# Altium schematic sheet 01-Insence_Power.SchDoc
size B; SheetNumber: 1
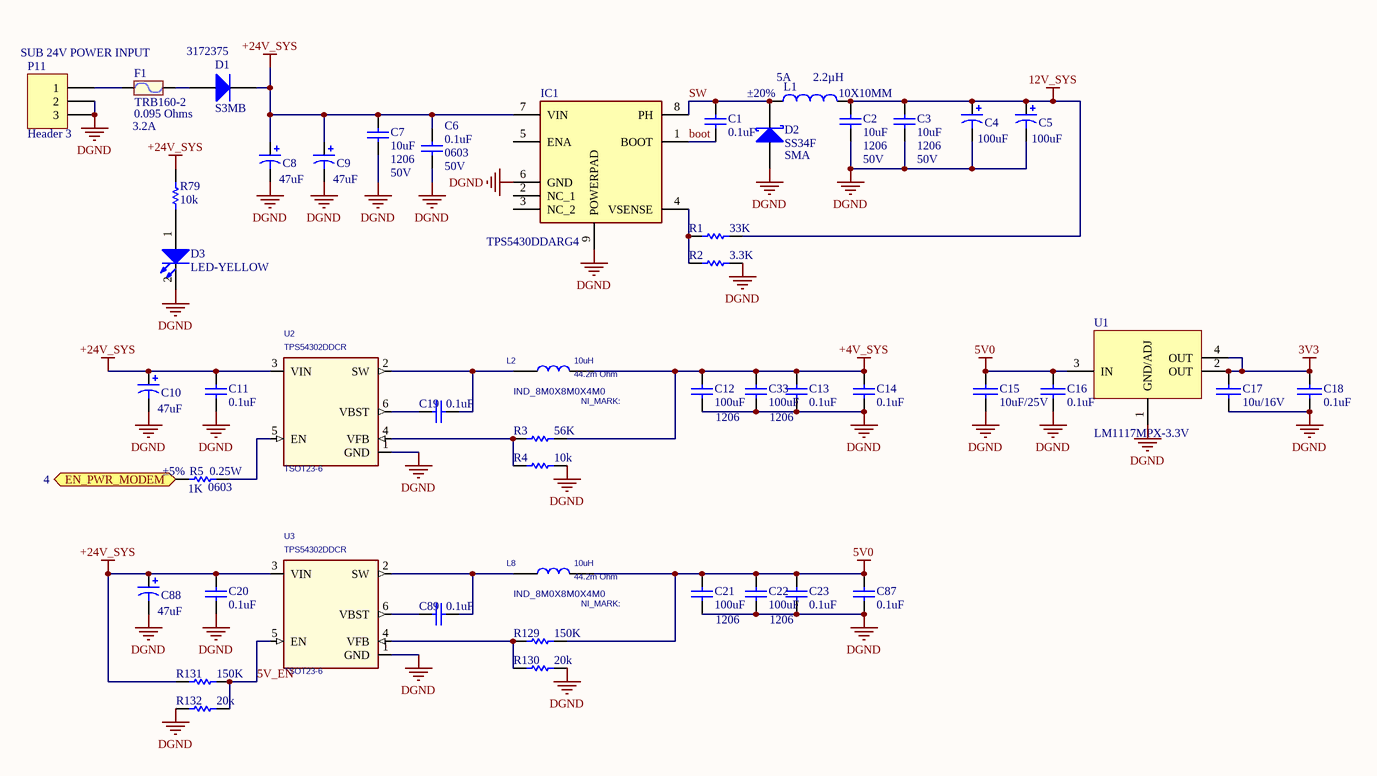
[diagram p0: 01-Insence_Power.SchDoc]

## Parts
C1  =Value: 0.1uF  [0805]  (hidden comment: Cap)
C2  FOOTPRINT: 1206  Voltage: 50V  [CAP 1206]  (hidden comment: 10uF)
C3  FOOTPRINT: 1206  Voltage: 50V  [CAP 1206]  (hidden comment: 10uF)
C4  100uF  [CAP ALUM SMD-D Package 6.3x5.4mm]
C5  100uF  [CAP ALUM SMD-D Package 6.3x5.4mm]
C6  FOOTPRINT: 0603  Voltage: 50V  [CAP 0603]  (hidden comment: 0.1uF)
C7  FOOTPRINT: 1206  Voltage: 50V  [CAP 1206]  (hidden comment: 10uF)
C8  47uF  [CAP ALUM SMD-D Package 6.3x5.4mm]
C9  47uF  [CAP ALUM SMD-D Package 6.3x5.4mm]
C10  47uF  [CAP ALUM SMD-D Package 6.3x5.4mm]
C11  =Value: 0.1uF  [0805]  (hidden comment: Cap)
C12  PCB FOOTPRINT: 1206  [CAP 1206]  (hidden comment: 100uF)
C13  =Value: 0.1uF  [0805]  (hidden comment: Cap)
C14  =Value: 0.1uF  [0805]  (hidden comment: Cap)
C15  10uF/25V  [0805]
C16  0.1uF  [0805]
C17  10u/16V  [0805]
C18  0.1uF  [0805]
C19  =Value: 0.1uF  [CAP 0603]  (hidden comment: Cap)
C20  =Value: 0.1uF  [0805]  (hidden comment: Cap)
C21  PCB FOOTPRINT: 1206  [CAP 1206]  (hidden comment: 100uF)
C22  PCB FOOTPRINT: 1206  [CAP 1206]  (hidden comment: 100uF)
C23  =Value: 0.1uF  [0805]  (hidden comment: Cap)
C33  PCB FOOTPRINT: 1206  [CAP 1206]  (hidden comment: 100uF)
C87  =Value: 0.1uF  [0805]  (hidden comment: Cap)
C88  47uF  [CAP ALUM SMD-D Package 6.3x5.4mm]
C89  =Value: 0.1uF  [CAP 0603]  (hidden comment: Cap)
D1  S3MB  Supplier Part Number 1: 3172375  [DO-214AB]
D2  SS34F  [SMA]
D3  LED-YELLOW  [led3mm_ra]
F1  DC Cold Resistance: 0.095 Ohms  Current Rating (Amps): 3.2A  [TRB160-2]  (hidden comment: TRB160-2)
IC1  TPS5430DDARG4  [SOIC127P600X170-9N]
L1  PCB Footprint: 10X10MM  RATE Current: 5A  Tolerance: ±20%  [IND 8x8MM]  (hidden comment: 2.2µH)
L2  10uH  PACKAGE: IND_8M0X8M0X4M0  DCR: 44.2m Ohm  [IND 8x8MM]
L8  10uH  PACKAGE: IND_8M0X8M0X4M0  DCR: 44.2m Ohm  [IND 8x8MM]
P11  Header 3  [DC-in]
R1  value 33K  [res 0603]  (hidden comment: Res1)
R2  value 3.3K  [res 0603]  (hidden comment: Res1)
R3  value 56K  [res 0603]  (hidden comment: Res1)
R4  value 10k  [res 0603]  (hidden comment: Res1)
R5  PCB Footprint: 0603  Power: 0.25W  Tolerance: ±5%  [res 0603]  (hidden comment: 1K)
R79  value 10k  [res 0603]  (hidden comment: Res1)
R129  value 150K  [res 0603]  (hidden comment: Res1)
R130  value 20k  [res 0603]  (hidden comment: Res1)
R131  value 150K  [res 0603]  (hidden comment: Res1)
R132  value 20k  [res 0603]  (hidden comment: Res1)
U1  LM1117MPX-3.3V  [SOT223]
U2  TPS54302DDCR  PACKAGE: TSOT23-6  [SOT23-6]
U3  TPS54302DDCR  PACKAGE: TSOT23-6  [SOT23-6]

## Ports
EN_PWR_MODEM (bidir, see 4)

## Nets
3V3: C17.1 C18.1 U1.2(OUT) U1.4(OUT)
5V0: C15.1 C16.1 C21.1 C22.1 C23.2 C87.2 L8.2(B) R129.2 U1.3(IN)
12V_SYS: C2.2 C3.2 C4.1 C5.1 L1.2 R1.2
+4V_SYS: C12.1 C13.2 C14.2 C33.1 L2.2(B) R3.2
+24V_SYS: C6.2 C7.2 C8.1 C9.1 C10.1 C11.2 C20.2 C88.1 D1.2(K) IC1.7(VIN) R79.2 R131.1 U2.3(VIN) U3.3(VIN)
DGND: C2.1 C3.1 C4.2 C5.2 C6.1 C7.1 C8.2 C9.2 C10.2 C11.1 C12.2 C13.1 C14.1 C15.2 C16.2 C17.2 C18.2 C20.1 C21.2 C22.2 C23.1 C33.2 C87.1 C88.2 D2.1(A) D3.2(K) IC1.6(GND) IC1.9(POWERPAD) P11.2 P11.3 R2.2 R4.2 R130.2 R132.1 U1.1(GND/ADJ) U2.1(GND) U3.1(GND)
5V_EN: R131.2 R132.2 U3.5(EN)
boot: C1.1 IC1.1(BOOT)
EN_PWR_MODEM: R5.2 ; port EN_PWR_MODEM
SW: C1.2 D2.2(K) IC1.8(PH) L1.1
NetC19_1: C19.1 U2.6(VBST)
NetC19_2: C19.2 L2.1(A) U2.2(SW)
NetC89_1: C89.1 U3.6(VBST)
NetC89_2: C89.2 L8.1(A) U3.2(SW)
NetD1_1: D1.1(A) F1.2
NetD3_1: D3.1(A) R79.1
NetF1_1: F1.1 P11.1
NetIC1_4: IC1.4(VSENSE) R1.1 R2.1
NetR3_1: R3.1 R4.1 U2.4(VFB)
NetR5_1: R5.1 U2.5(EN)
NetR129_1: R129.1 R130.1 U3.4(VFB)

Not connected (* = marked no-connect by the designer): IC1 2(NC_1) 3(NC_2) 5(ENA)

## Notes on the sheet
- SUB 24V POWER INPUT

## Library data of the parts
C1 C11 C13 C14 C20 C23 C87 = Cap: CAP CER 0.1UF 50V X7R 0805; MANUFACTURER1: Cal-Chip Electronics, Inc.; MANUFACTURER1_PART#: GMC21X7R104M50NT; Published: 8-Jun-2000; LatestRevisionDate: 17-Jul-2002; LatestRevisionNote: Re-released for DXP Platform.; PackageReference: RAD-0.3; Publisher: Altium Limited; PackageDescription: Radial Cap, Thru-Hole; 2 Leads; 0.3 in Pin Spacing
C2 C3 C7 = Cap: CAP CER 10UF 50V X5R 1206; MANUFACTURER1: Samsung Electro-Mechanics; MANUFACTURER1_PART#: CL31A106MBHNNNE; MANUFACTURER1: SS; Unit: PCS; Material: X7R; PACKING: Tape & Reel (TR); Process Type: SM; Tolerance: ±10%; CATEGORY: CAP-CER; VALUE: 10uF; PCB FOOTPRINT: 1206
C4 C5 = Cap TANTAN 100UF35V2917_1: CAP ALUM 100UF 20% 16V SMD; MANUFACTURER1_PART#: UWX1C101MCL1GB; MANUFACTURER1: Nichicon; MANUFACTURER2_PART#: EDK107M016A9GAA; TEMP: 0-85; DIA: 6.3mm; Value: 100uF; MANUFACTURER2: KEMET; LOH_CODE: *; VOLTAGE: 16V; TOLERANCE: 20%; CATEGORY: CAP-POL-SMD
C6 = Cap: CAP-CER,SMD;0.1UF,10%,50V,X7R,0603; MANUFACTURER1: Samsung Electro-Mechanics; MANUFACTURER1_PART#: CL10B104KB8NNNC; MANUFACTURER2_PART#: M0603X104K050TAX; MANUFACTURER1: SS; Unit: PCS; PACKING: Tape & Reel (TR); Process Type: SM; CATEGORY: CAP-CER; VALUE: 0.1uF; Material: X7R; PCB FOOTPRINT: 0603; Tolerance: ±10%; MANUFACTURER2: UWA
C8-C10 C88 = Cap TANTAN 47UF35V2917: CAP ALUM 47UF 20% 35V SMD; MANUFACTURER1_PART#: UUR1V470MCL6GS; MANUFACTURER1: Nichicon; MANUFACTURER2_PART#: EDK476M035A9GAA; TEMP: 0-85; DIA: 6.3mm; Value: 47uF; MANUFACTURER2: KEMET; LOH_CODE: *; VOLTAGE: 35V; TOLERANCE: 20%; CATEGORY: CAP-POL-SMD
C12 C21 C22 C33 = Cap: CAP CER 100UF 6.3V X5R 1206; MANUFACTURER1: Taiyo Yuden; MANUFACTURER1_PART#: JMK316BJ107ML-T; MANUFACTURER2_PART#: JMK107BJ475KA-T; Unit: PCS; PACKING: Tape & Reel (TR); Process Type: SM; Tolerance: ±10%; CATEGORY: CAP-CER; VALUE: 100uF; Material: X5R; Voltage: 6.3V; MANUFACTURER2: Yageo
C15 = CAP: CAP CER 10UF 25V X5R 0805; MANUFACTURER1: Cal-Chip Electronics, Inc.; MANUFACTURER1_PART#: GMC21X5R106M25NT
C16 C18 = CAP: CAP CER 0.1UF 50V X7R 0805; MANUFACTURER1: Cal-Chip Electronics, Inc.; MANUFACTURER1_PART#: GMC21X7R104M50NT
C17 = CAP: CAP CER 10UF 16V X5R 0805; MANUFACTURER1: Cal-Chip Electronics, Inc.; MANUFACTURER1_PART#: GMC21X5R106K16NT
C19 C89 = Cap: CAP CER 0.1UF 50V X5R 0603; MANUFACTURER1: Cal-Chip Electronics, Inc.; MANUFACTURER1_PART#: GMC10X5R104M50NT; Published: 8-Jun-2000; LatestRevisionDate: 17-Jul-2002; LatestRevisionNote: Re-released for DXP Platform.; PackageReference: RAD-0.3; Publisher: Altium Limited; PackageDescription: Radial Cap, Thru-Hole; 2 Leads; 0.3 in Pin Spacing
D1 = Diode: Default Diode; MANUFACTURER1: Diodes; MANUFACTURER1_PART#: S3MB-13-F; Published: 8-Jun-2000; LatestRevisionDate: 17-Jul-2002; LatestRevisionNote: Re-released for DXP Platform.; PackageVersion: Sep-1996; PackageReference: SMC; Publisher: Altium Limited; PackageDescription: DO-214-AB/SMC; 2 C-Bend Leads; Body 7.9 x 5.9 mm, inc. leads (LxW); Code_JEDEC: DO-214-AB; Supplier 1: Future Electronics
D2 = D Schottky: Diode 40 V 3A Surface Mount SMAF; MANUFACTURER1: MDD; Published: 8-Jun-2000; LatestRevisionDate: 17-Jul-2002; LatestRevisionNote: Re-released for DXP Platform.; PackageReference: SMA; Publisher: Altium Limited; PackageDescription: DO-214-AA/SMB; 2 C-Bend Leads; Body 5.3 x 3.6 mm, inc. leads (LxW); Code_JEDEC: DO-214-AA; Supplier 1: Newark; Supplier Part Number 1: 90AJ6552; MANUFACTURER1_PART#: SS34F
D3 = LED-RED: LED_3MM,2V,20mA,GREEN; PACKING: Tape & Reel (TR); Process Type: SM; Unit: PCS; Value: LED GREEN; Category: LED SMD; PCB Footprint: LED_3MM; MANUFACTURER1_PART#: https://banlinhkien.com/led-3mm-xanh-la-duc-10c-p12117293.html
F1 = 0875.800MXEP: Polymeric 30V 3.2A 8s 95mO Through Hole,P=5.1mm,L=3.8mm PTC; MANUFACTURER2_PART#: JK30-160; MANUFACTURER1: TLC Electronic; PROCESS_TYPE: MA; Unit: PCS; CATEGORY: FUSE; MANUFACTURER1_PART#: TRB160-2; MANUFACTURER2: Jinrui Electronic Materials Co.; Response Time: 8s; Breaking Capacity @ Rated Voltage: 3.2A; Voltage - Rated: 30V; Value: TRB160-2; Package / Case: TH2
IC1 = TPS5430DDARG4: Integrated Circuit; Manufacturer_Name: Texas Instruments; Datasheet Link: http://www.ti.com/general/docs/suppproductinfo.tsp?distId=10&gotoUrl=http%3A%2F%2Fwww.ti.com%2Flit%2Fgpn%2Ftps5431; Height: 1.7mm; Manufacturer_Part_Number: TPS5430DDARG4; Mouser Part Number: 595-TPS5430DDARG4; Mouser Price/Stock: https://www.mouser.co.uk/ProductDetail/Texas-Instruments/TPS5430DDARG4?qs=zwk82MlA57YG4K%2FfUMTveg%3D%3D; MANUFACTURER1: Texas Instruments; MANUFACTURER1_PART#: TPS5430DDARG4
L1 = inductor 2.2uF: FIXED IND 22UH 5A SMD 8x8mm; MANUFACTURER1: Bourns Inc.; MANUFACTURER1_PART#: SRP7050WA-220M; PACKING: Tape & Reel (TR); Process Type: SM; Unit: PCS; SAT CURENT: 5.6A; Category: Inductor; Value: 2.2µH
L2 L8 = IND_10uH_3.1A_44.2mOhm_8MX8MX4M: IND-SMD;10uH,20%,8x8x4mm,3.1A,44.2mOHM; MFG1_PART#: NR8040T100M; DISTR1_PART#: 587-2001-2-ND; PSpice Template: L^@REFDES %A %B @ MODEL @VALUE; BY: VINFAST_RD; MFG1: TAIYO YUDEN; PROCESS: SM; DISTR1: DIGIKEY; Current: 3.1A; Tolerance: 20%; Category: INDUCTOR; TYPE: IND-SMD; VFCODE: NR8040T100M; Tolerance6: 20%; MANUFACTURER1: Taiyo Yuden; MANUFACTURER1_PART#: NR8040T100M
P11 = Header 3: CONN PWR JACK 2X5.5MM SOLDER; MANUFACTURER1: 4840.2201; MANUFACTURER1_PART#: SCHURTER Inc.; LatestRevisionDate: 17-Jul-2002; LatestRevisionNote: Re-released for DXP Platform.; Publisher: Altium Limited
R1 = Res1: RES SMD 33K OHM 1% 1/10W 0603; MANUFACTURER1: Cal-Chip Electronics, Inc.; MANUFACTURER1_PART#: RM06F3302CT; Published: 8-Jun-2000; LatestRevisionDate: 17-Jul-2002; LatestRevisionNote: Re-released for DXP Platform.; PackageReference: AXIAL-0.3; Publisher: Altium Limited; PackageDescription: Axial Device, Thru-Hole; 2 Leads; 0.3 in Pin Spacing
R2 = Res1: RES SMD 3.3K OHM 1% 1/10W 0603; MANUFACTURER1: Cal-Chip Electronics, Inc.; MANUFACTURER1_PART#: RM06F3301CT; Published: 8-Jun-2000; LatestRevisionDate: 17-Jul-2002; LatestRevisionNote: Re-released for DXP Platform.; PackageReference: AXIAL-0.3; Publisher: Altium Limited; PackageDescription: Axial Device, Thru-Hole; 2 Leads; 0.3 in Pin Spacing
R3 R129 R131 = Res1: RES SMD 56K OHM 1% 1/10W 0603; MANUFACTURER1: Cal-Chip Electronics, Inc.; MANUFACTURER1_PART#: RM06F7322CT; Published: 8-Jun-2000; LatestRevisionDate: 17-Jul-2002; LatestRevisionNote: Re-released for DXP Platform.; PackageReference: AXIAL-0.3; Publisher: Altium Limited; PackageDescription: Axial Device, Thru-Hole; 2 Leads; 0.3 in Pin Spacing
R4 R79 R130 R132 = Res1: RES SMD 10K OHM 1% 1/10W 0603; MANUFACTURER1: Cal-Chip Electronics, Inc.; MANUFACTURER1_PART#: RM06F1302CT; Published: 8-Jun-2000; LatestRevisionDate: 17-Jul-2002; LatestRevisionNote: Re-released for DXP Platform.; PackageReference: AXIAL-0.3; Publisher: Altium Limited; PackageDescription: Axial Device, Thru-Hole; 2 Leads; 0.3 in Pin Spacing
R5 = Res0.3: RES SMD,1K OHM,5%,1/10W,0603; MANUFACTURER1: Stackpole Electronics Inc; MANUFACTURER1_PART#: RMCF06031K00JNEAC; MANUFACTURER2_PART#: R0603J1KTG; DESCCRIPTION: RES SMD 1K OHM 5% 1/10W 0603; PACKING: Tape & Reel (TR); Process Type: SM; Unit: PCS; LOH_Code: 140100083; Value: 1K; CATEGORY: RES SMD; MANUFACTURER2: UWA
U1 = LM1117: LDO, LM1117MPX-3.3V
U2 U3 = IC_TPS54302DDCR: IC REG BUCK ADJ 3A TSOT23-6,TPS54302DDCR; DISTR1_PART#: 296-46237-1-ND; BY: VINFAST_RD; DISTR1: DIGIKEY; MFG1: Texas Instruments; PROCESS: SM; Category: IC; MFG1_PART#: TPS54302DDCR; TYPE: IC; VFCODE: TPS54302DDCR; MANUFACTURER1: Texas Instruments; MANUFACTURER1_PART#: TPS54302DDCR